# EAGLE design OSO-MISC-20-013 Bluefruit Adapter (EAGLE 9.4.2)
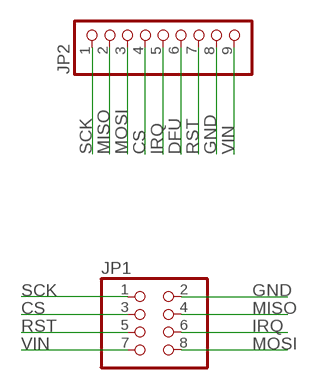
[diagram p0: schematic, sheet 1]

## Parts
JP1  PINHD-2X4  [2X04]
JP2  PINHD-1X9  [1X09]

## Nets
CS: JP1.3 JP2.4
DFU: JP2.6
GND: JP1.2 JP2.8
IRQ: JP1.6 JP2.5
MISO: JP1.4 JP2.2
MOSI: JP1.8 JP2.3
RST: JP1.5 JP2.7
SCK: JP1.1 JP2.1
VIN: JP1.7 JP2.9

## Library data of the parts
JP1 = pinhead:PINHD-2X4: PIN HEADER
JP2 = pinhead:PINHD-1X9: PIN HEADER

## Board
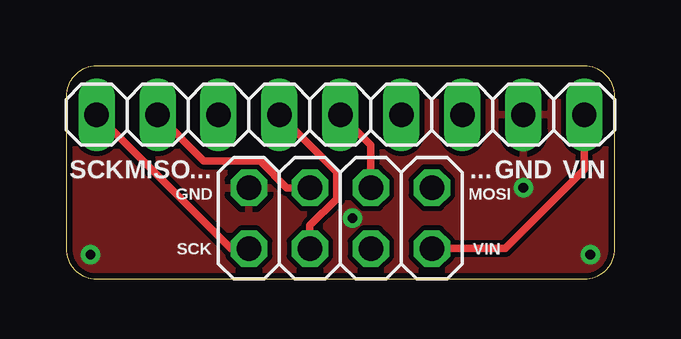
[diagram p1: board, top side]
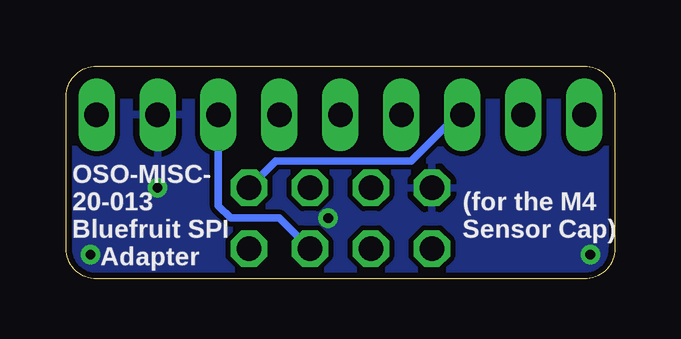
[diagram p2: board, bottom side, seen from below]

Size 22.86 x 8.89 mm. Coordinates in mm from the lower left corner, seen from the top.
Outline: 1.27,0 21.59,0 arc90 22.86,1.27 22.86,7.62 arc90 21.59,8.89 1.27,8.89 arc90 0,7.62 0,1.27 arc90 1.27,0
Copper layers (1*16): Top 0.035mm / dielectric 1.5mm / Bottom 0.035mm
Design rules "adafruit": minimum track width 8mil, minimum drill 15.5mil, track to track 8mil, track to pad 8mil, pad to pad 8mil, via to via 8mil, smd to smd 8mil, copper to edge 10mil, drill to drill 8mil, minimum pad ring 10mil, minimum via ring 8mil, stop-mask expansion 2mil, vias tented up to drill 20mil, thermal gap 10mil

### Footprints (pad centres in the part's own frame; a part is rotated, then mirrored left to right if it is on the bottom)
2X04 = drill 1.016 octagon: 1 -3.81,-1.27; 2 -3.81,1.27; 3 -1.27,-1.27; 4 -1.27,1.27; 5 1.27,-1.27; 6 1.27,1.27; 7 3.81,-1.27; 8 3.81,1.27
1X09 = drill 1.016 long: 1 -10.16,0; 2 -7.62,0; 3 -5.08,0; 4 -2.54,0; 5 0,0; 6 2.54,0; 7 5.08,0; 8 7.62,0; 9 10.16,0

### Placement (x,y rotation side)
JP1  11.43,2.54 0 top
JP2  11.43,6.86 0 top

### Tracks (layer width: path | path; a pad name or v marks a point on that pad's centre or on a via)
CS
  Top 0.305: JP1.3 10.16,2.23 11.28,3.35 11.28,4.47 JP2.4
GND  (via drill 0.41)
  other vias: 11.94,2.54 19.05,3.81 1.02,1.02 21.84,1.02
  pour Bottom: -0.25,7.37 23.11,7.37 23.11,-0.25 -0.25,-0.25
  pour Top: 23.11,7.37 -0.25,7.37 -0.25,-0.25 23.11,-0.25
IRQ
  Top 0.305: JP2.5 12.7,5.59 JP1.6
MISO
  Top 0.305: JP2.2 5.74,4.93 8.08,4.93 9.2,3.81 JP1.4
MOSI
  Bottom 0.305: JP2.3 6.55,6.86 8.48,4.93 14.12,4.93 JP1.8
RST
  Bottom 0.305: JP1.5 13.97,2.54 16,2.54 16.51,3.05 JP2.7
SCK
  Top 0.305: JP2.1 6.86,1.27 JP1.1
VIN
  Top 0.305: JP1.7 18.29,1.27 21.59,4.57 JP2.9

### Text on the board
tPlace: SCK | MISO | ... | ... | GND | VIN | GND | MOSI | SCK | VIN
bPlace: (for the M4 / Sensor Cap) | OSO-MISC- / 20-013 / Bluefruit SPI / Adapter